# EAGLE design led_serial_strip_small (EAGLE 6.5.0)
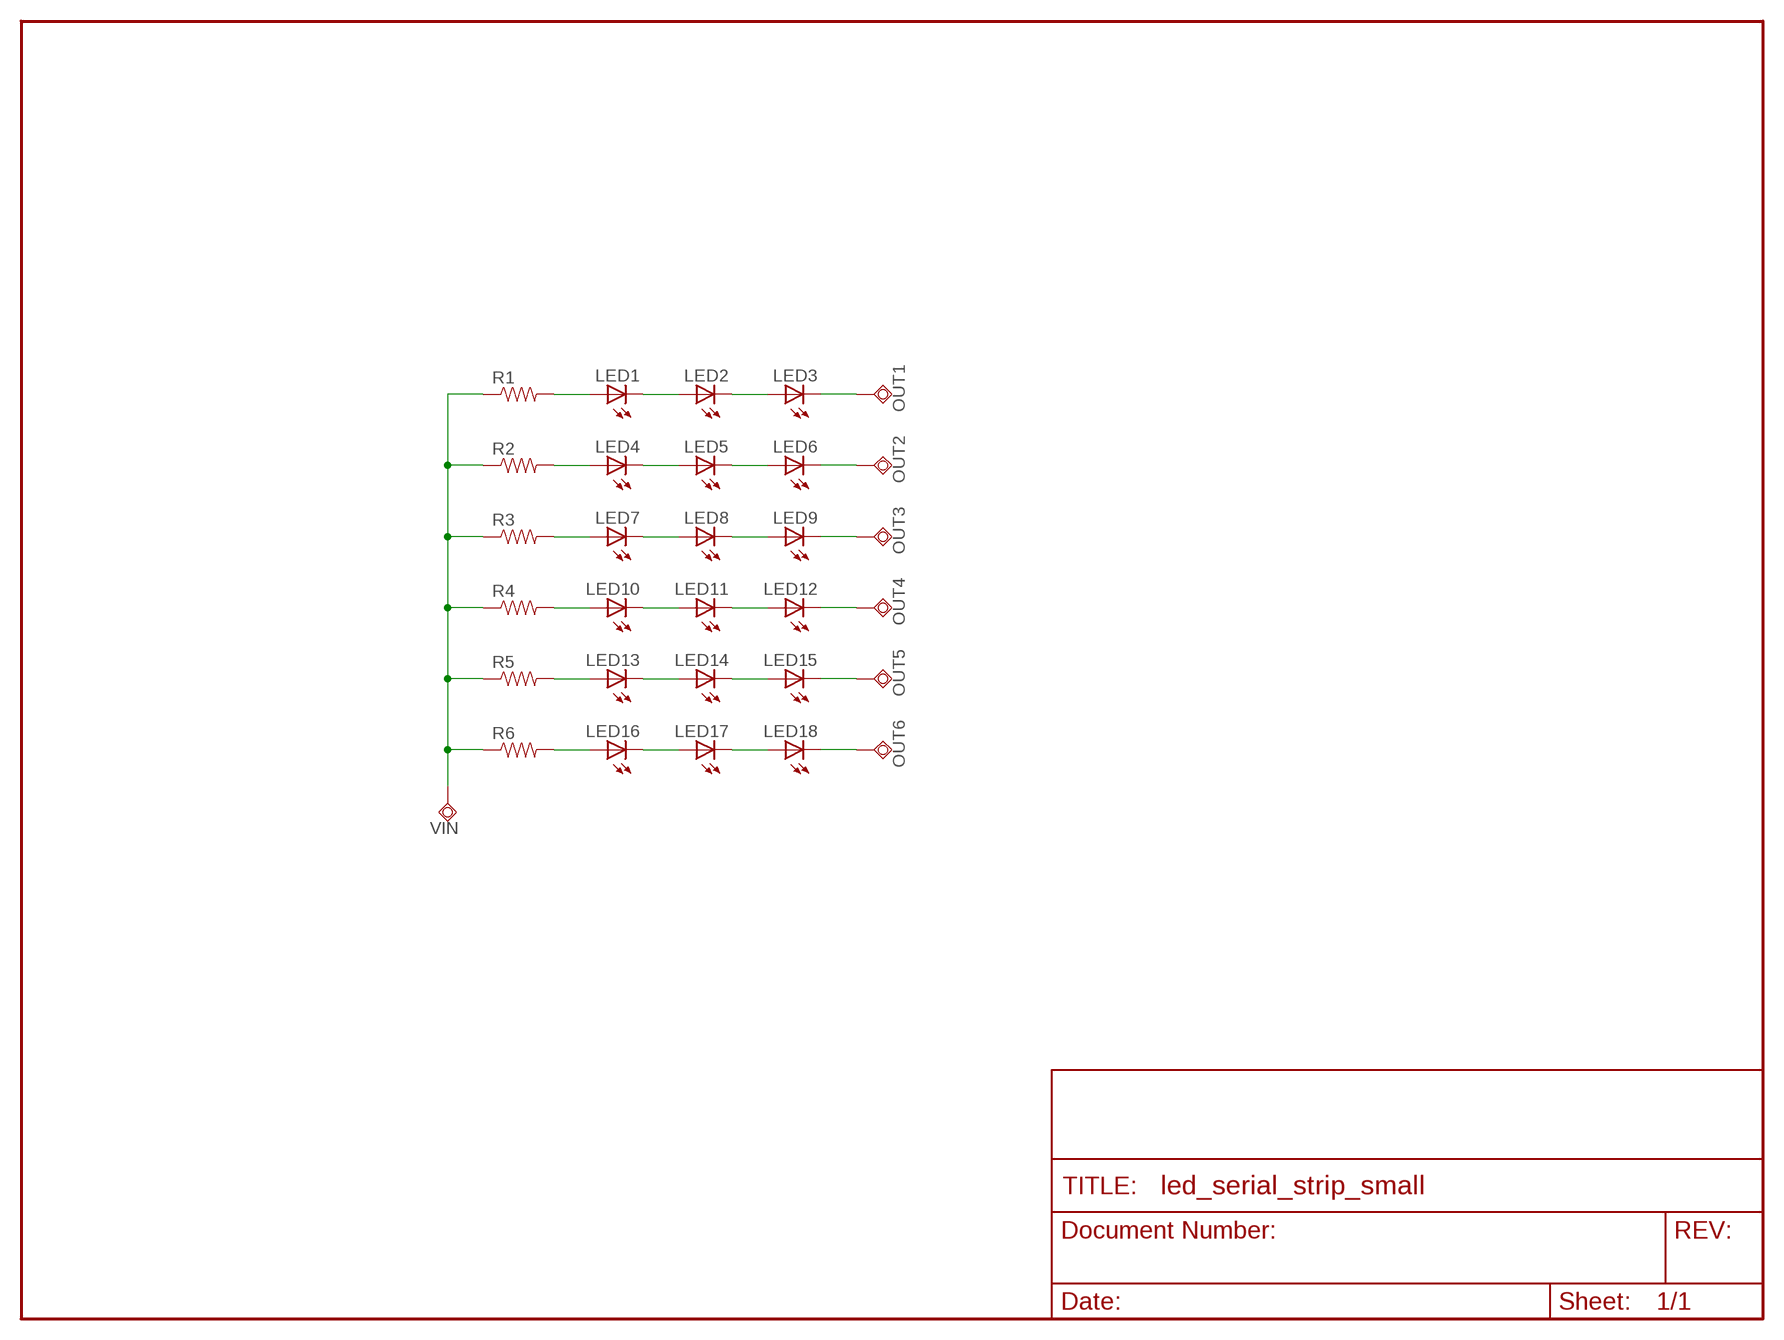
[diagram p0: schematic, sheet 1]

## Parts
LED1  LED0805  [LED_0805]
LED2  LED0805  [LED_0805]
LED3  LED0805  [LED_0805]
LED4  LED0805  [LED_0805]
LED5  LED0805  [LED_0805]
LED6  LED0805  [LED_0805]
LED7  LED0805  [LED_0805]
LED8  LED0805  [LED_0805]
LED9  LED0805  [LED_0805]
LED10  LED0805  [LED_0805]
LED11  LED0805  [LED_0805]
LED12  LED0805  [LED_0805]
LED13  LED0805  [LED_0805]
LED14  LED0805  [LED_0805]
LED15  LED0805  [LED_0805]
LED16  LED0805  [LED_0805]
LED17  LED0805  [LED_0805]
LED18  LED0805  [LED_0805]
OUT1  TPSQTP15SQ  [TP15SQ]
OUT2  TPSQTP15SQ  [TP15SQ]
OUT3  TPSQTP15SQ  [TP15SQ]
OUT4  TPSQTP15SQ  [TP15SQ]
OUT5  TPSQTP15SQ  [TP15SQ]
OUT6  TPSQTP15SQ  [TP15SQ]
R1  RESISTOR0805-RES  [0805]
R2  RESISTOR0805-RES  [0805]
R3  RESISTOR0805-RES  [0805]
R4  RESISTOR0805-RES  [0805]
R5  RESISTOR0805-RES  [0805]
R6  RESISTOR0805-RES  [0805]
VIN  TPSQTP15SQ  [TP15SQ]

## Nets
N$1: LED1.A R1.2
N$2: LED1.C LED2.A
N$3: LED2.C LED3.A
N$4: LED4.A R2.2
N$5: LED7.A R3.2
N$6: LED10.A R4.2
N$7: LED10.C LED11.A
N$8: LED11.C LED12.A
N$9: LED8.C LED9.A
N$10: LED5.C LED6.A
N$11: LED4.C LED5.A
N$12: LED7.C LED8.A
N$13: LED3.C OUT1.TP
N$14: LED6.C OUT2.TP
N$15: LED9.C OUT3.TP
N$16: LED12.C OUT4.TP
N$17: LED13.A R5.2
N$18: LED16.A R6.2
N$19: LED16.C LED17.A
N$20: LED17.C LED18.A
N$21: LED14.C LED15.A
N$22: LED13.C LED14.A
N$23: LED15.C OUT5.TP
N$24: LED18.C OUT6.TP
VIN: R1.1 R2.1 R3.1 R4.1 R5.1 R6.1 VIN.TP

## Library data of the parts
LED1-LED18 = CyberRailGuru:LED: LEDs Standard schematic elements and footprints for 5mm, 3mm, 1206, and 0603 sized LEDs. 5mm - Spark Fun Electronics SKU : COM-00529 (and others)
OUT1-OUT6 VIN = CyberRailGuru:TPSQ: Test pad
R1-R6 = SparkFun:RESISTOR: Resistor Basic schematic elements and footprints for 0603, 1206, and PTH resistors.

## Board
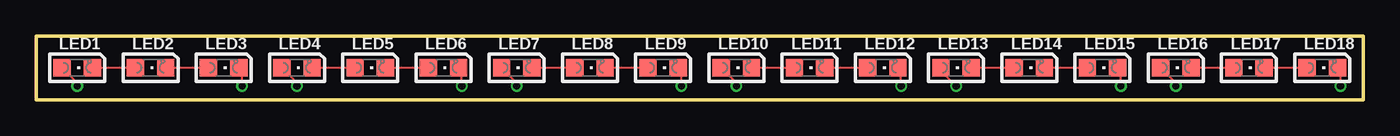
[diagram p1: board, top side]
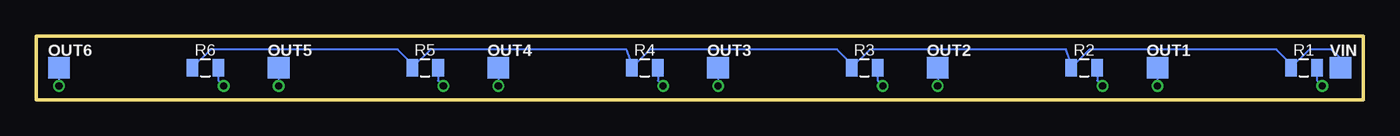
[diagram p2: board, bottom side, seen from below]

Size 92.08 x 4.43 mm. Coordinates in mm from the lower left corner, seen from the top.
Outline: 0,0 92.08,0 92.08,4.43 0,4.43 0,0
Copper layers (1*16): Top 0.035mm / dielectric 1.5mm / Bottom 0.035mm
Design rules "Fusion_eagle_rule_v1.1": minimum track width 6mil, minimum drill 12mil, track to track 6mil, track to pad 6mil, pad to pad 6mil, via to via 6mil, smd to smd 0mil, copper to edge 10mil, drill to drill 10mil, minimum pad ring 10mil, minimum via ring 6mil, stop-mask expansion 2mil, vias tented up to drill 100mil, thermal gap 10mil

### Footprints (pad centres in the part's own frame; a part is rotated, then mirrored left to right if it is on the bottom)
LED_0805 = smd 1.2 x 1.2: A 0,-1.05; C 0,1.05
TP15SQ = smd 1.5 x 1.5: TP 0,0
0805 = smd 0.8 x 1.2: 1 -0.9,0; 2 0.9,0

### Placement (x,y rotation side)
LED1  2.86,2.22 270 top
LED2  7.94,2.22 270 top
LED3  13.02,2.22 270 top
LED4  18.1,2.22 270 top
LED5  23.18,2.22 270 top
LED6  28.26,2.22 270 top
LED7  33.34,2.22 270 top
LED8  38.42,2.22 270 top
LED9  43.5,2.22 270 top
LED10  48.58,2.22 270 top
LED11  53.66,2.22 270 top
LED12  58.74,2.22 270 top
LED13  63.82,2.22 270 top
LED14  68.9,2.22 270 top
LED15  73.98,2.22 270 top
LED16  79.06,2.22 270 top
LED17  84.14,2.22 270 top
LED18  89.22,2.22 270 top
OUT1  14.29,2.22 0 bottom
OUT2  29.53,2.22 0 bottom
OUT3  44.77,2.22 0 bottom
OUT4  60.01,2.22 0 bottom
OUT5  75.25,2.22 0 bottom
OUT6  90.49,2.22 0 bottom
R1  4.13,2.22 0 bottom
R2  19.37,2.22 0 bottom
R3  34.61,2.22 0 bottom
R4  49.85,2.22 0 bottom
R5  65.09,2.22 0 bottom
R6  80.33,2.22 0 bottom
VIN  1.59,2.22 0 bottom

### Tracks (layer width: path | path; a pad name or v marks a point on that pad's centre or on a via)
N$1  (via drill 0.5)
  Top 0.152: v2.86,0.95 2.86,1.17 LED1.A
  Bottom 0.152: R1.2 3.23,1.32 v2.86,0.95
N$2
  Top 0.152: LED1.C LED2.A
N$3
  Top 0.152: LED2.C LED3.A
N$4  (via drill 0.5)
  Top 0.152: v18.1,0.95 18.1,1.17 LED4.A
  Bottom 0.152: R2.2 18.47,1.32 v18.1,0.95
N$5  (via drill 0.5)
  Top 0.152: v33.34,0.95 33.34,1.17 LED7.A
  Bottom 0.152: R3.2 33.71,1.32 v33.34,0.95
N$6  (via drill 0.5)
  Top 0.152: v48.58,0.95 48.58,1.17 LED10.A
  Bottom 0.152: R4.2 48.95,1.32 v48.58,0.95
N$7
  Top 0.152: LED10.C LED11.A
N$8
  Top 0.152: LED11.C LED12.A
N$9
  Top 0.152: LED8.C LED9.A
N$10
  Top 0.152: LED5.C LED6.A
N$11
  Top 0.152: LED4.C LED5.A
N$12
  Top 0.152: LED7.C LED8.A
N$13  (via drill 0.5)
  Top 0.152: v14.29,0.95 14.29,2 LED3.C
  Bottom 0.152: OUT1.TP v14.29,0.95
N$14  (via drill 0.5)
  Top 0.152: v29.53,0.95 29.53,2 LED6.C
  Bottom 0.152: OUT2.TP v29.53,0.95
N$15  (via drill 0.5)
  Top 0.152: v44.77,0.95 44.77,2 LED9.C
  Bottom 0.152: OUT3.TP v44.77,0.95
N$16  (via drill 0.5)
  Top 0.152: v60.01,0.95 60.01,2 LED12.C
  Bottom 0.152: OUT4.TP v60.01,0.95
N$17  (via drill 0.5)
  Top 0.152: v63.82,0.95 63.18,1.59 63.18,1.81 LED13.A
  Bottom 0.152: R5.2 64.19,1.32 v63.82,0.95
N$18  (via drill 0.5)
  Top 0.152: v79.06,0.95 79.06,1.17 LED16.A
  Bottom 0.152: R6.2 79.43,1.32 v79.06,0.95
N$19
  Top 0.152: LED16.C LED17.A
N$20
  Top 0.152: LED17.C LED18.A
N$21
  Top 0.152: LED14.C LED15.A
N$22
  Top 0.152: LED13.C LED14.A
N$23  (via drill 0.5)
  Top 0.152: v75.25,0.95 75.25,2 LED15.C
  Bottom 0.152: OUT5.TP v75.25,0.95
N$24  (via drill 0.5)
  Top 0.152: v90.49,0.95 90.49,2 LED18.C
  Bottom 0.152: OUT6.TP v90.49,0.95
VIN
  Bottom 0.152: R6.1 79.96,3.49 66.99,3.49 65.99,2.49 R5.1 64.72,3.49 51.12,3.49 50.75,2.49 R4.1 49.48,3.49 36.51,3.49 35.51,2.49 R3.1 34.24,3.49 20.64,3.49 20.27,2.49 R2.1 19,3.49 6.03,3.49 5.03,2.49 R1.1 3.76,3.49 2.22,3.49 1.59,2.86 VIN.TP